# EasyEDA Pro project ProPrj_智能视觉集成板-V3.0.epro, schematic Schematic2_3
Board Name: 单ART拓展版_青春版; Create Date: 2025-07-11; Page Name: P1; Project Name: 009-智能视觉集成板-V3.0; Schematic Name: Schematic2_3; Update Date: 2025-07-11; Company: 嘉立创EDA; Page Size: A4; Version: V1.0
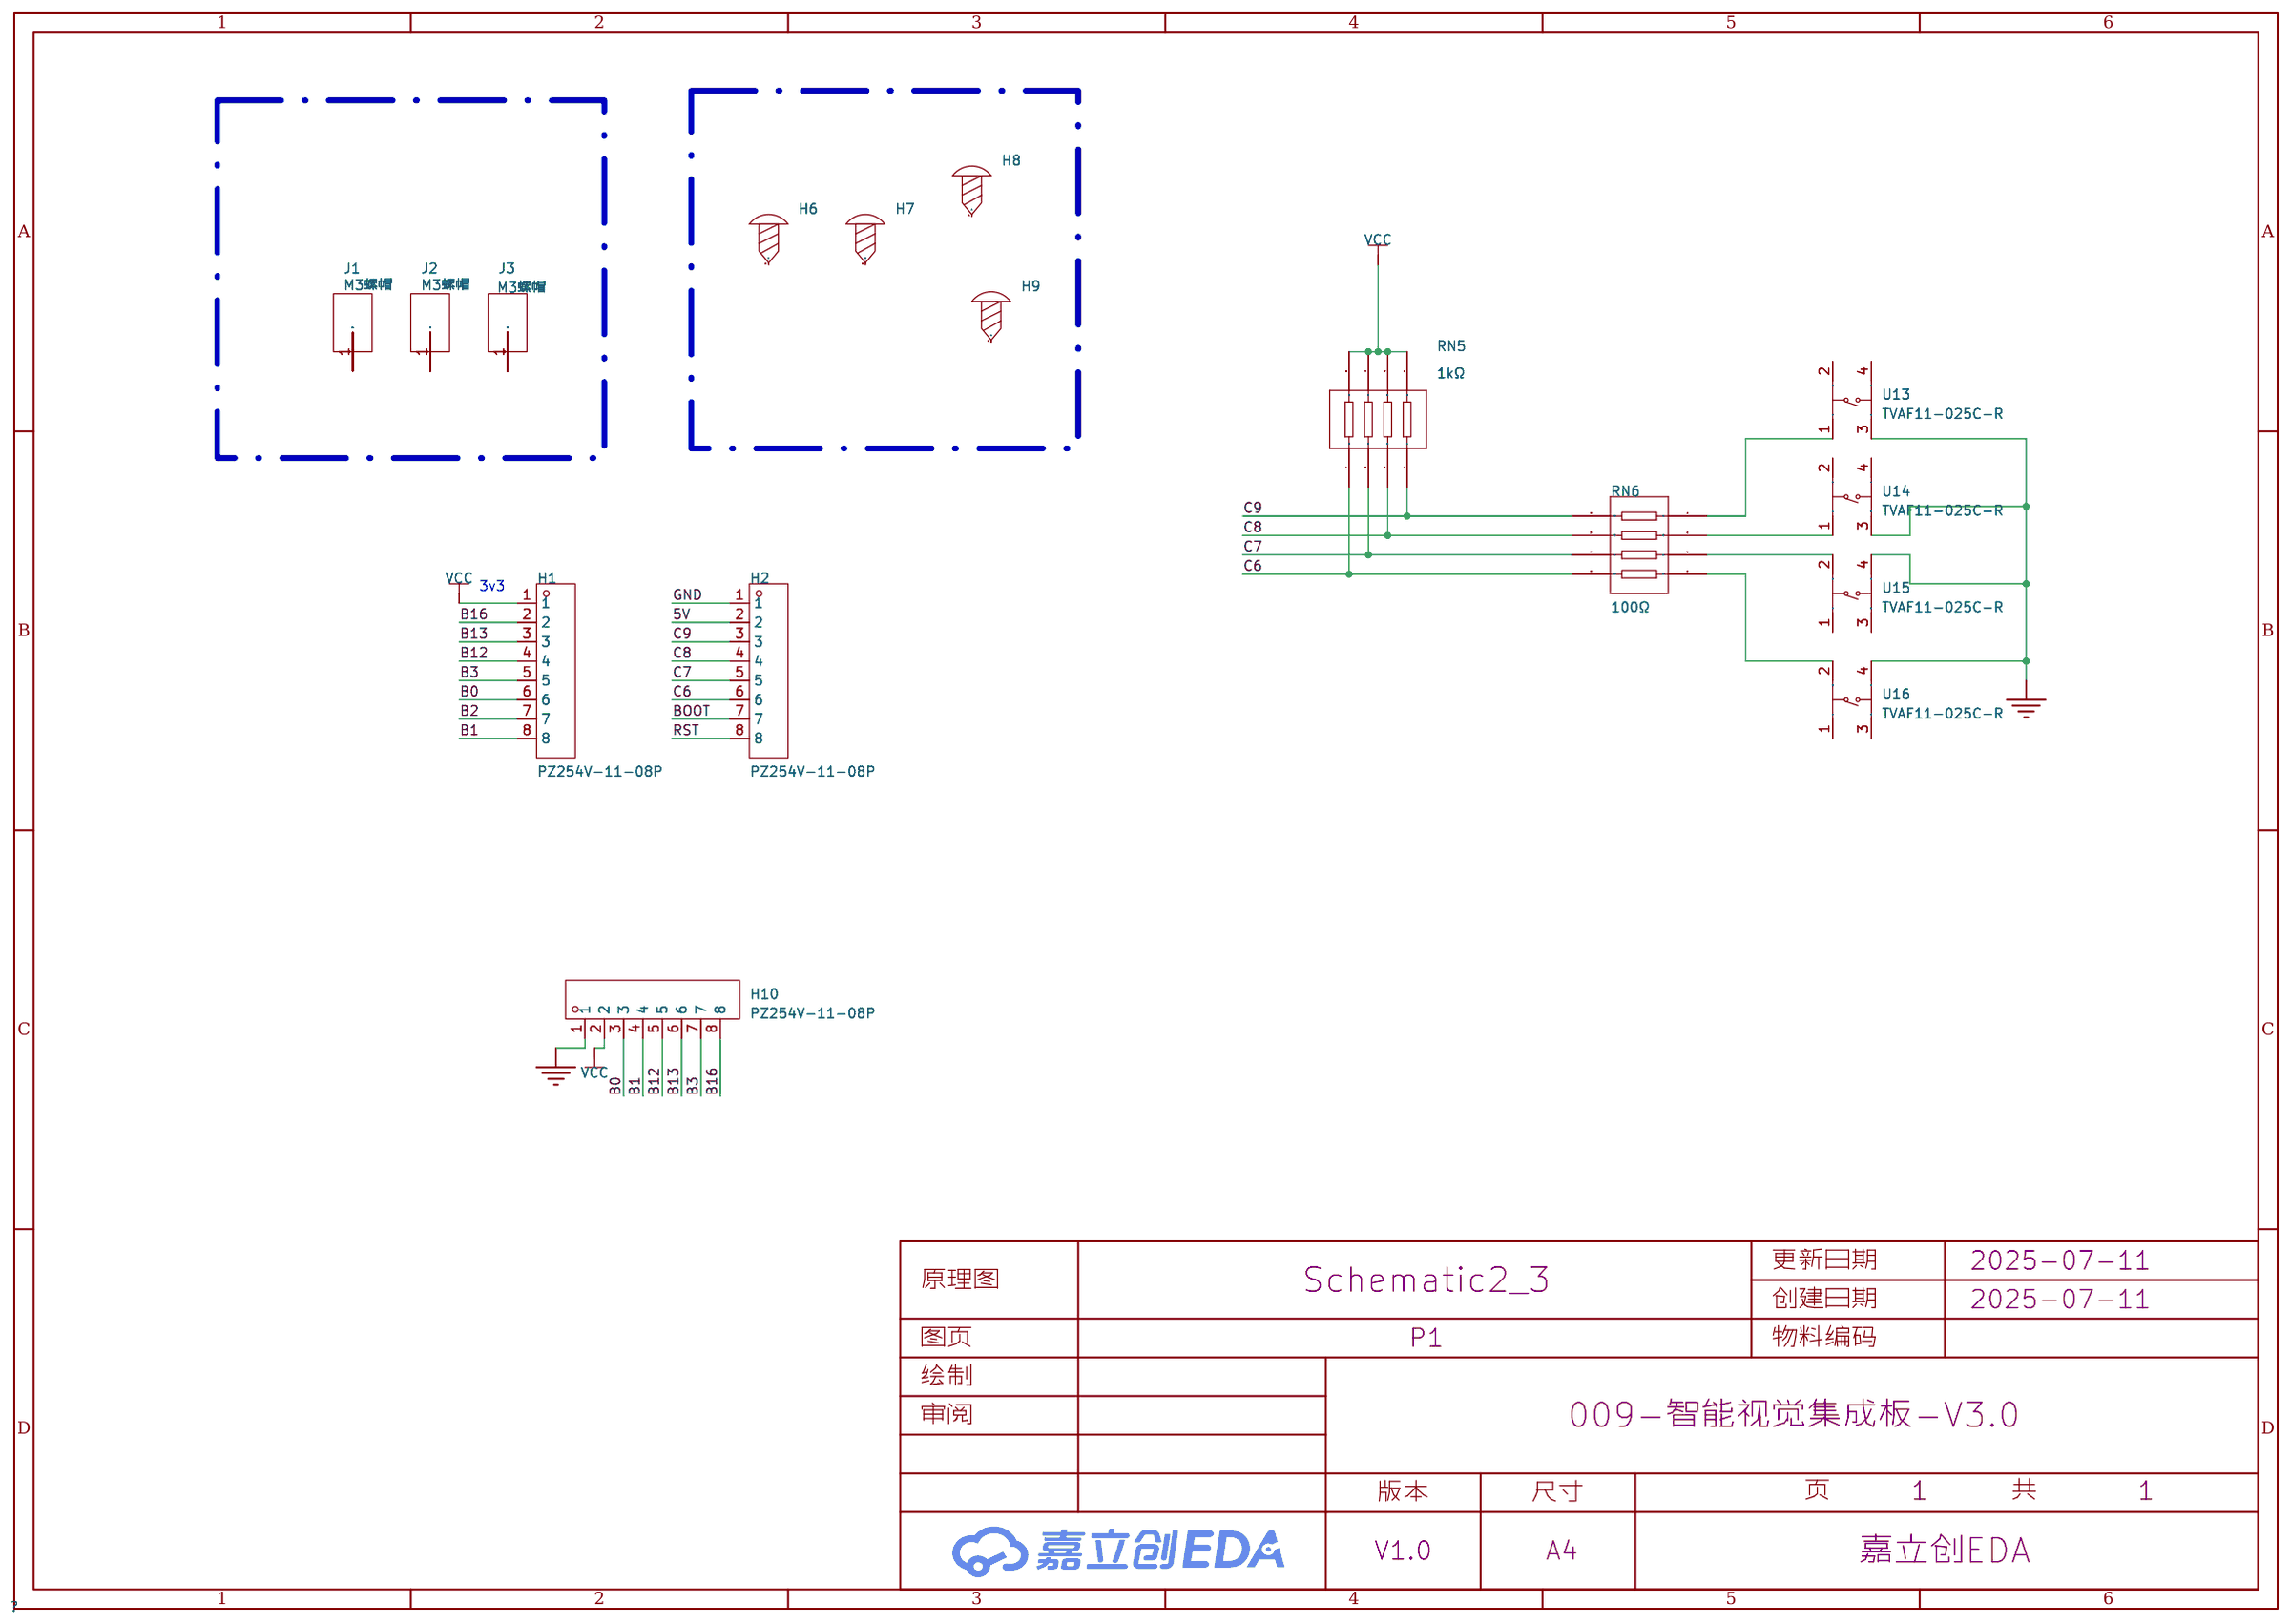
[diagram p18: schematic sheet]

## Parts
H1  PZ254V-11-08P  [HDR-TH_8P-P2.54-V-M]
H2  PZ254V-11-08P  [HDR-TH_8P-P2.54-V-M]
H6  -  [Screw_R2.2mm]
H7  -  [Screw_R2.2mm]
H8  -  [Screw_R2.2mm]
H9  -  [Screw_R2.2mm]
H10  PZ254V-11-08P  [HDR-TH_8P-P2.54-V-M]
J1  M3螺帽  [M3螺帽]
J2  M3螺帽  [M3螺帽]
J3  M3螺帽  [M3螺帽]
RN5  1kΩ  [RES-ARRAY-SMD_0603-8P-L3.2-W1.6-BL]
RN6  100Ω  [RES-ARRAY-SMD_0603-8P-L3.2-W1.6-BL]
U13  TVAF11-025C-R  [SW-SMD_4P-L4.2-W3.2-P2.15-LS5.2]
U14  TVAF11-025C-R  [SW-SMD_4P-L4.2-W3.2-P2.15-LS5.2]
U15  TVAF11-025C-R  [SW-SMD_4P-L4.2-W3.2-P2.15-LS5.2]
U16  TVAF11-025C-R  [SW-SMD_4P-L4.2-W3.2-P2.15-LS5.2]

## Library data of the parts
H1 H2 H10 = PZ254V-11-08P: 插针结构:1x8P;间距:2.54mm;行距:-;圆针/方针:方针;安装类型:直插;排数:单排;总PIN位数:8P;额定电流:-;额定电压:-;配合针长度:6mm;塑高:2.5mm;端接针长度:3mm;触头材质:黄铜;触头镀层:-;工作温度范围:-40℃~+105℃;颜色:黑色;; LCSC Part Name: 间距:2.54mm 1x8P 直插 方针; Supplier Part: C492407; Manufacturer: XFCN(兴飞); Supplier Footprint: 插件,P=2.54mm; JLCPCB Part Class: 扩展库; Datasheet: https://atta.szlcsc.com/upload/public/pdf/source/20200309/C492407_83A6FB26A2233368EDB9516968EC6149.pdf; Supplier: LCSC; Pin Structure: 1x8P; Pitch: 2.54mm; Circluar Pins/Square Pins: 方针; Mounting Type: 直插; Number of Rows: 单排; Number of Pins: 8P; Length of Mating Pin: 6mm; Insulation Height: 2.5mm; Length of End Connection Pin: 3mm; Contact Material: 黄铜; Operating Temperature Range: -40℃~+105℃; Color: 黑色
H6-H9 = Screw_M2
J1-J3 = M3螺帽
RN5 = YC164-FR-071KL: 电阻器数:4;阻值:1kΩ;精度:±1%;单个元件功率:62.5mW;温度系数:±200ppm/℃;; LCSC Part Name: 1kΩ ±1%; Supplier Part: C110021; Manufacturer: YAGEO(国巨); Supplier Footprint: 0603x4; JLCPCB Part Class: 扩展库; Datasheet: https://atta.szlcsc.com/upload/public/pdf/source/20170428/1493376791474.pdf; Supplier: LCSC; Number of Resistors: 4; Tolerance: ±1%; Power(Watts): 62.5mW; Temperature Coefficient: ±200ppm/℃; Number of Pins: 8
RN6 = 4D03WGJ0101T5E: 电阻器数:4;阻值:100Ω;精度:±5%;单个元件功率:62.5mW;温度系数:±200ppm/℃;; LCSC Part Name: 100Ω ±5%; Supplier Part: C25506; Manufacturer: UNI-ROYAL(厚声); Supplier Footprint: 0603x4; JLCPCB Part Class: Extended Part; Datasheet: https://atta.szlcsc.com/upload/public/pdf/source/20191224/C474318_2527498AE30E813171187CCD28401A71.pdf; Supplier: LCSC; Number of Resistors: 4; Tolerance: ±5%; Power(Watts): 62.5mW; Temperature Coefficient: ±200ppm/℃; Number of Pins: 8
U13-U16 = TVAF11-025C-R: LCSC Part Name: 3X4/平脚/2.5H/250gf/全白/编带; Supplier Part: C19271017; Manufacturer: jianfu(键富); Supplier Footprint: SMD-4P,4.2x3.2mm; JLCPCB Part Class: 扩展库; Datasheet: https://atta.szlcsc.com/upload/public/pdf/source/20231226/FB98EE413CD12D7D25E049A307AF8350.pdf; Supplier: LCSC

## Nets
5V: H2.2
GND: H2.1 H10.1 U13.3 U14.3 U15.4 U16.4
VCC: H1.1 H10.2 RN5.5 RN5.6 RN5.7 RN5.8
B0: H1.6 H10.3
B1: H1.8 H10.4
B2: H1.7
B3: H1.5 H10.7
B12: H1.4 H10.5
B13: H1.3 H10.6
B16: H1.2 H10.8
BOOT: H2.7
C6: H2.6 RN5.1 RN6.8
C7: H2.5 RN5.2 RN6.7
C8: H2.4 RN5.3 RN6.6
C9: H2.3 RN5.4 RN6.5
RST: H2.8
$1N3764: RN6.4 U13.1
$1N3765: RN6.3 U14.1
$1N3766: RN6.2 U15.2
$1N3767: RN6.1 U16.2

Not connected (* = marked no-connect by the designer): H6 1; H7 1; H8 1; H9 1; J1 1; J2 1; J3 1; U13 2 4; U14 2 4; U15 1 3; U16 1 3

## Notes on the sheet
- 3v3
